# EasyEDA Pro project ProPrj_ST-Link_2025-02-09.epro, board ST-LINK_v2
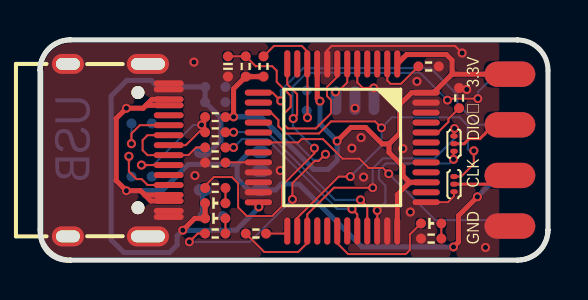
[diagram p3: board, top side]
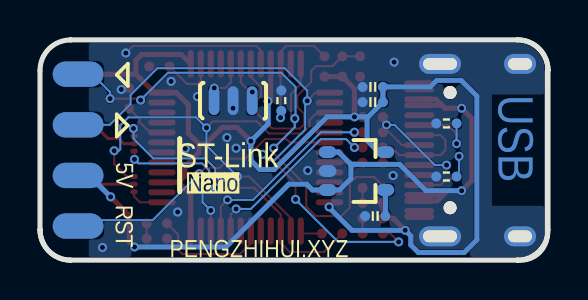
[diagram p4: board, bottom side, seen from below]

Outline 25.4 x 11.05 mm; copper layers: Top Layer, Bottom Layer. Coordinates in mm from the lower left corner of the outline.
Outline path: 0,9.52 0,1.53 arc(0.45,0.45) 1.52,0 ; 0,9.52 arc(0.45,10.6) 1.52,11.05 ; 0,9.52 arc(0.45,10.6) 1.52,11.05 ; 1.52,11.05 23.88,11.05 23.88,11.04 arc(24.95,10.6) 25.4,9.52 25.4,1.52 ; 0.04,9.49 0.04,1.19 arc(0.53,0.29) 1.52,0 ; 1.52,0 1.52,0 23.87,0 ; 23.87,0 arc(24.95,0.45) 25.4,1.52 25.4,1.52 ; 23.87,0 arc(24.95,0.45) 25.4,1.52
Stack: Top Layer 0.0356mm / Dielectric 1 0.254mm FR-4 er 4.2 / Bottom Layer 0.0356mm

## Design rules (mm)
net R14: Inside Board Components
net R15: Inside Board Components
net J2: Inside Board Components
net J1: Inside Board Components
net U1: Inside Board Components
net Y1: Inside Board Components
net USB1: Inside Board Components
net U2: Inside Board Components
net SWDOUT1: Inside Board Components
net R13: Inside Board Components
net R12: Inside Board Components
net R11: Inside Board Components
net R10: Inside Board Components
net R9: Inside Board Components
net R8: Inside Board Components
net R7: Inside Board Components
net R6: Inside Board Components
net R5: Inside Board Components
net R4: Inside Board Components
net R3: Inside Board Components
net R2: Inside Board Components
net R1: Inside Board Components
net D3: Inside Board Components
net D2: Inside Board Components
net D1: Inside Board Components
net C4: Inside Board Components
net C3: Inside Board Components
net C2: Inside Board Components
net C1: Inside Board Components
net USB_P: USB
net USB_N: USB
spacing Clearance (default): track to track 0.127, other pairs 0.127 to 0.127
track width Width (default): min 0.102, default 0.102, max 254
differential pair DiffPairsRouting (default): width min 0.102, default 0.102, max 0.102; gap min 0.229, default 0.229
via RoutingVias (default): diameter min 0.305, default 0.406, max 1.27; hole min 0.152, default 0.203, max 0.711

## Placement (name value [footprint] x y rotation side)
C1  0.1u  [CAP_0402]  9.4 9.72 90 top
C2  0.1u  [CAP_0402]  8.76 8.69 180 bottom
C3  0.1u  [CAP_0402]  8.76 7.92 180 bottom
C4  0.1u  [CAP_0402]  8.64 2.21 180 bottom
D1  color?  [LED_0402_BLUE]  8.76 2.1 0 top
D2  color?  [LED_0402_YELLOW]  8.76 2.86 0 top
D3  color?  [LED_0402_GREEN]  19.56 1.84 0 top
J1  选择跳线  [jumper-3]  20.7 5.84 270 top
J2  选择跳线  [jumper-3]  20.7 3.81 270 top
R1  22R  [RES_0402]  11.18 9.72 90 top
R2  22R  [RES_0402]  13.34 8 90 bottom
R3  22R  [RES_0402]  8.76 4.89 180 top
R4  22R  [RES_0402]  8.76 1.33 0 top
R5  22R  [RES_0402]  8.76 3.62 0 top
R6  22R  [RES_0402]  19.56 1.08 0 top
R7  22R  [RES_0402]  8.76 5.65 0 top
R8  22R  [RES_0402]  10.79 1.33 180 top
R9  22R  [RES_0402]  8.76 6.41 0 top
R10  22R  [RES_0402]  19.43 9.72 180 top
R11  22R  [RES_0402]  20.95 8.13 90 top
R12  22R  [RES_0402]  10.29 9.72 270 top
R13  22R  [RES_0402]  8.76 7.18 0 top
R14  22R  [RES_0402]  5.08 6.86 0 bottom
R15  22R  [RES_0402]  5.08 4.19 0 bottom
SWDOUT1  HDR2x4_2.54  [HDR2X4_2.54_180H]  23.5 9.33 0 top
U1  STM32F103CBT6  [LQFP-48]  15.11 5.65 270 top
U2  SPX3819M5  [SOT23-5]  9.53 4.47 180 bottom
USB1  Type-C  [Type-C-TOP]  3.92 5.52 180 top
Y1  8MHz  [晶振-3P]  15.75 8 0 bottom

## Footprints (pads in the part's own frame, mm; a bottom-side part is the same pattern mirrored in y, then rotated)
CAP_0402
  rrect 0.508x0.508 smd: 1(-0.508,0) 2(0.508,0)
HDR2X4_2.54_180H
  rrect 2.54x1.27 smd: 1(0,0) 3(0,-2.54) 5(0,-5.08) 7(0,-7.62)
  rrect 2.54x1.27 smd far side: 2(0,0) 4(0,-2.54) 6(0,-5.08) 8(0,-7.62)
jumper-3
  rrect 0.254x0.381 smd: 1(-0.381,0) 2(0,0) 3(0.381,0)
LED_0402_BLUE
  rrect 0.508x0.508 smd: 1(-0.508,0) 2(0.508,0)
LED_0402_GREEN
  rrect 0.508x0.508 smd: 1(-0.508,0) 2(0.508,0)
LED_0402_YELLOW
  rrect 0.508x0.508 smd: 1(-0.508,0) 2(0.508,0)
LQFP-48
  oval 1.371x0.305 smd: 1(-4.191,2.75) 2(-4.191,2.25) 3(-4.191,1.75) 4(-4.191,1.25) 5(-4.191,0.75) 6(-4.191,0.25) 7(-4.191,-0.25) 8(-4.191,-0.75) 9(-4.191,-1.25) 10(-4.191,-1.75) 11(-4.191,-2.25) 12(-4.191,-2.75) 25(4.191,-2.75) 26(4.191,-2.25) 27(4.191,-1.75) 28(4.191,-1.25) 29(4.191,-0.75) 30(4.191,-0.25) 31(4.191,0.25) 32(4.191,0.75) 33(4.191,1.25) 34(4.191,1.75) 35(4.191,2.25) 36(4.191,2.75)
  oval 0.305x1.371 smd: 13(-2.75,-4.191) 14(-2.25,-4.191) 15(-1.75,-4.191) 16(-1.25,-4.191) 17(-0.75,-4.191) 18(-0.25,-4.191) 19(0.25,-4.191) 20(0.75,-4.191) 21(1.25,-4.191) 22(1.75,-4.191) 23(2.25,-4.191) 24(2.75,-4.191) 37(2.75,4.191) 38(2.25,4.191) 39(1.75,4.191) 40(1.25,4.191) 41(0.75,4.191) 42(0.25,4.191) 43(-0.25,4.191) 44(-0.75,4.191) 45(-1.25,4.191) 46(-1.75,4.191) 47(-2.25,4.191) 48(-2.75,4.191)
RES_0402
  rrect 0.508x0.508 smd: 1(-0.508,0) 2(0.508,0)
SOT23-5
  rrect 0.889x0.6 smd: 1(-1.5,0.95) 2(-1.5,0) 3(-1.5,-0.95) 4(1.395,-0.95) 5(1.395,0.95)
Type-C-TOP
  round 0.65 hole 0.65: 0(-0.98,2.89) 0(-0.98,-2.89)
  oval 1.6x1 hole 1.2x0.6: 1(2.52,4.325) 2(2.52,-4.325)
  oval 2.1x1 hole 1.7x0.6: 3(-1.48,-4.325) 4(-1.48,4.325)
  rrect 1.5x0.3 smd: A1(-2.52,-3.35) A4(-2.52,-2.55) A5(-2.52,-1.25) A6(-2.52,-0.25) A7(-2.52,0.25) A8(-2.52,1.25) A9(-2.52,2.55) A12(-2.52,3.35) B1(-2.52,3.05) B4(-2.52,2.25) B5(-2.52,1.75) B6(-2.52,0.75) B7(-2.52,-0.75) B8(-2.52,-1.75) B9(-2.52,-2.25) B12(-2.52,-3.05)
晶振-3P
  rrect 0.55x1.45 smd: 1(-0.95,0) 2(0,0) 3(0.95,0)

## Nets
As in the schematic.

Pads without a net: U1 3 4 11 14 19 22 28 29 40 41 42 43 45 46; USB1 0 A8 B8

## Via types
v1: diameter 0.457, hole 0.254, Top Layer to Bottom Layer, 50 vias

## Routing (per net, layer and track width the routed paths; a pad name or vN(x,y) marks a point on that pad's centre or on a via; arc(x,y) is an arc through that point)
3V3: length 65.1
  Top Layer w0.254: 17.45,5.83 17.98,6.36 17.98,7.8 18.59,8.4 U1.48 19.68,8.4 20.6,9.33 ; 17.45,5.83 17.11,5.83 16.28,6.66 15.54,6.66 v1(14.86,5.97) ; 17.45,5.83 17.45,5.4 18.15,4.7 18.15,4.23 18.48,3.9 ; R13.2 9.66,7.18 v1(9.68,7.19) 9.68,8.6 R12.2 R1.1 ; 18.48,3.9 17.86,3.28 U1.36 ; 18.48,3.9 U1.39 ; U1.24 10.92,2.69 v1(10.94,2.67) ; v1(7.14,1.5) 7.73,2.1 D1.1 D2.1 ; U1.9 13.86,8.11 v1(14,7.98) ; 20.6,9.33 23.62,9.33 ; 20.6,9.33 20.6,10.03 20.32,10.31 18.33,10.31 U1.1
  Bottom Layer w0.254: 9.04,7.19 v1(9.68,7.19) 11.05,7.19 13.69,4.55 14.4,4.55 14.86,5 v1(14.86,5.97) 14,6.83 v1(14,7.98) ; 9.04,7.19 9.04,5.99 8.47,5.42 U2.5 ; 9.04,7.19 8.99,7.19 C3.2 C2.2 5.89,8.69 5.56,9.02 4.34,9.02 3.56,8.23 3.56,1.02 4.19,0.38 6.48,0.38 6.86,0.76 6.86,1.22 v1(7.14,1.5) 9.8,1.5 10.94,2.64 v1(10.94,2.67)
5V: length 37.4
  Top Layer w0.254: USB1.A9 5.54,2.97 5.24,3.27 ; v1(21.87,3.17) 20.93,2.23 20.93,0.91 v1(20.68,0.66) ; 5.24,3.27 USB1.B4 ; 5.24,3.27 5.03,3.48 v1(4.32,3.48) 3.81,3.99 3.81,7.11 v1(4.32,7.62) 5.16,7.62 5.3,7.77 ; USB1.A4 5.6,8.07 5.3,7.77 ; 5.3,7.77 USB1.B9
  Bottom Layer w0.254: v1(4.32,3.48) 6.1,3.48 7.42,4.8 9.85,4.8 ; U2.1 10.47,5.42 9.85,4.8 ; 9.85,4.8 9.85,4.09 10.42,3.52 U2.3 11.78,3.52 12.06,3.81 12.95,3.81 16.1,0.66 v1(20.68,0.66) ; v1(21.87,3.17) 22.94,4.25 23.62,4.25
GND: length 7.7
  Top Layer w0.102: U1.8 14.36,10.53 14.58,10.74 20.75,10.74 v1(21.11,10.39)
  vias: v1(7.7,9.93) v1(7.75,4.24) v1(12.01,4.5) v1(15.6,5.61) v1(15.75,7.62) v1(16.05,6.15) v1(16.18,4.17) v1(17.53,8.2) v1(18.14,5.6) v1(18.52,2.41) v1(18.85,8.97) v1(21.34,8.56) v1(22.28,0.64)
JTCK: length 22.6
  Top Layer w0.102: U1.26 12.86,2.12 14.94,4.19 v1(15.52,4.19) ; v1(17.08,6.64) 16.76,6.96 14.55,6.96 13.94,6.35 12.28,6.35 11.92,6.71 11.92,7.03 11.55,7.4 U1.15 ; J2.1 21.06,4.19 21.69,4.83 v1(21.69,5.49)
  Bottom Layer w0.102: v1(21.69,5.49) 21.46,5.49 21.39,5.56 21.39,6.76 20.98,7.16 17.6,7.16 v1(17.08,6.64) 17.08,5.75 v1(15.52,4.19)
JTMS: length 15.5
  Top Layer w0.102: v1(20.73,6.6) 20.7,6.58 J1.1 ; R8.2 11.21,0.41 12.91,0.41 13.36,0.86 U1.27 13.36,2.3 14.7,3.63 v1(16.64,3.63)
  Bottom Layer w0.102: v1(20.73,6.6) 20.73,6.1 19.74,5.11 17.15,5.11 16.64,4.6 v1(16.64,3.63)
LED_RUN: length 6.1
  Top Layer w0.102: D3.1 18.49,1.28 18.49,0.51 18.29,0.3 15.41,0.3 14.86,0.85 U1.30
NETC1_2: length 11.4
  Top Layer w0.102: U1.7 14.86,9.2 14.35,8.69 14.35,8.23 14.55,8.03 14.55,7.37 13.79,6.6 12.4,6.6 12.19,6.81 12.19,7.34 12.53,7.68 12.53,8.24 11.84,8.94 11.84,9.5 11.61,9.73 10.78,9.73 R12.1 C1.2
NETC4_2: length 1.3
  Bottom Layer w0.254: C4.2 U2.4
NETD1_2: length 0.8
  Top Layer w0.102: R4.2 D1.2
NETD2_2: length 0.8
  Top Layer w0.102: D2.2 R5.2
NETD3_2: length 0.8
  Top Layer w0.102: R6.2 D3.2
NETJ1_2: length 3.2
  Top Layer w0.152: SWDOUT1.3 22.69,6.79 22,6.1 21.46,6.1 21.21,5.84 J1.2
NETJ2_2: length 3.1
  Top Layer w0.152: J2.2 23.18,3.81 23.62,4.25
NETR1_2: length 6.2
  Top Layer w0.102: R1.2 11.7,10.74 13.09,10.74 13.36,10.47 U1.10 13.37,9.83 v1(13.37,7.15)
  Bottom Layer w0.102: v1(13.37,7.15) 13.36,7.16 13.36,7.47 R2.1
NETR3_1: length 1.6
  Top Layer w0.102: 9.28,4.9 U1.20
NETR7_2: length 9.2
  Top Layer w0.102: R7.2 v1(9.68,5.65) ; U1.32 15.86,2.3 v1(15.6,2.57)
  Bottom Layer w0.102: v1(15.6,2.57) 14.86,2.57 11.35,6.07 10.1,6.07 v1(9.68,5.65)
NETR8_1: length 1.1
  Top Layer w0.102: U1.25 12.24,1.33 R8.1
NETR9_2: length 9.9
  Top Layer w0.102: U1.33 16.36,2.69 v1(16.03,3.02) ; R9.2 v1(9.68,6.41)
  Bottom Layer w0.102: v1(16.03,3.02) 14.75,3.02 11.36,6.41 v1(9.68,6.41)
NETR10_2: length 2.8
  Top Layer w0.102: R10.2 18.05,8.84 17.53,8.84 17.36,9 U1.2
NETR11_1: length 2.2
  Top Layer w0.102: R11.1 20.42,7.09 20.42,6.93 19.89,6.4 U1.44
NETR14_1: length 3.6
  Top Layer w0.102: v1(4.57,5.84) 4.57,6.35 4.99,6.77 USB1.A5
  Bottom Layer w0.102: v1(4.57,5.84) 4.57,6.86
NETR15_1: length 4.1
  Top Layer w0.102: USB1.B5 5.38,3.77 5.08,4.06 4.83,4.06 4.44,4.44 v1(4.44,5.21)
  Bottom Layer w0.102: v1(4.44,5.21) 4.44,4.32 4.57,4.19
NETU1_5: length 1.9
  Top Layer w0.102: v1(16.69,8.64) 16.14,8.64 15.86,8.91 U1.5
NETU1_6: length 2.1
  Top Layer w0.102: v1(14.78,8.43) 14.88,8.43 15.36,8.91 U1.6
  Bottom Layer w0.102: Y1.1 14.78,8.02 v1(14.78,8.43)
NRST: length 15
  Top Layer w0.102: 16.43,4.62 16.81,4.62 ; 16.43,4.62 17.15,4.62 v1(17.44,4.33) ; 16.43,4.62 15.96,5.09 15.13,5.09 14.15,6.07 13.08,6.07 12.91,5.9 U1.18
  Bottom Layer w0.102: v1(17.44,4.33) 19.76,2.01 23.32,2.01 23.62,1.71
RX: length 29.6
  Top Layer w0.102: R4.1 7.89,1.33 v1(7.47,0.91) ; v1(14.28,5.31) 13.93,4.97 13.73,4.97 12.62,3.86 v1(12.62,3.05) ; v1(12.04,7.99) 11.62,8.4 U1.13
  Bottom Layer w0.102: v1(12.62,3.05) 10.49,0.91 v1(7.47,0.91) ; v1(14.28,5.31) 14,5.03 13.66,5.03 12.14,6.55 12.14,7.88 v1(12.04,7.99) 12.04,8.51 13.16,9.63 19.53,9.63 20.87,8.28 20.87,7.83 21.91,6.79 SWDOUT1.4
ST_SWCLK: length 1.7
  Top Layer w0.102: J2.3 20.7,3.2 20.4,2.9 U1.37
ST_SWDIO: length 7.7
  Top Layer w0.102: v1(20.68,5.05) 20.68,5.44 J1.3 ; U1.34 v1(16.86,2.49)
  Bottom Layer w0.102: v1(20.68,5.05) 20.47,4.85 17.3,4.85 16.94,4.5 16.94,4.06 17.27,3.73 17.27,2.9 v1(16.86,2.49)
TX: length 28.5
  Top Layer w0.102: v1(13.72,5.61) 13.72,5.36 12.09,3.73 12.09,2.69 11.61,2.21 10.34,2.21 9.91,2.64 9.91,3.85 9.59,4.17 8.69,4.17 8.25,3.73 R5.1 ; v1(21.9,8.1) 20.45,8.1 v1(20.37,8.03) ; U1.12 12.36,8.82 12.85,8.33 12.85,7.29 v1(12.66,7.1)
  Bottom Layer w0.102: v1(13.72,5.61) 12.66,6.67 v1(12.66,7.1) 12.62,7.14 12.62,8.69 13.34,9.4 19,9.4 v1(20.37,8.03) ; v1(21.9,8.1) 21.9,8.43 22.79,9.33 SWDOUT1.2
USB_N: length 5.3
  Top Layer w0.102: R7.1 7.81,5.65 7.43,5.27 USB1.A7 5.38,5.27 5.13,5.51 5.13,6.02 5.38,6.27 USB1.B7
USB_P: length 8.5
  Top Layer w0.102: 8.19,6.48 8,6.48 7.29,5.77 USB1.A6 ; 8.19,6.48 8.08,6.59 v1(8.08,6.78) ; 8.19,6.48 R9.1 R13.1 ; v1(5.07,4.77) USB1.B6
  Bottom Layer w0.102: v1(5.07,4.77) 5.66,4.77 7.67,6.78 v1(8.08,6.78)

## Copper pours and planes (outline as drawn; the poured copper is in the pictures)
GND on Top Layer: 0,11.05 22.86,11.05 22.86,0 0,0
GND on Bottom Layer: 0,11.05 22.86,11.05 22.86,0 0,0

Small or netless copper shapes (teardrops, artwork), in the pictures only: 120 on Top Layer, 58 on Bottom Layer

## Text on the board
Bottom Layer: USB
Bottom Silkscreen Layer: 5V | RST | Nano | PENGZHIHUI.XYZ | ST-Link
Top Silkscreen Layer: 3.3V | CLK | GND | DIO
